# Altium schematic sheet Main.SchDoc: Main
size A3; DrawnBy: Mogens Groth Nicolaisen; DocumentNumber: 2; SheetNumber: 2; SheetTotal: 7
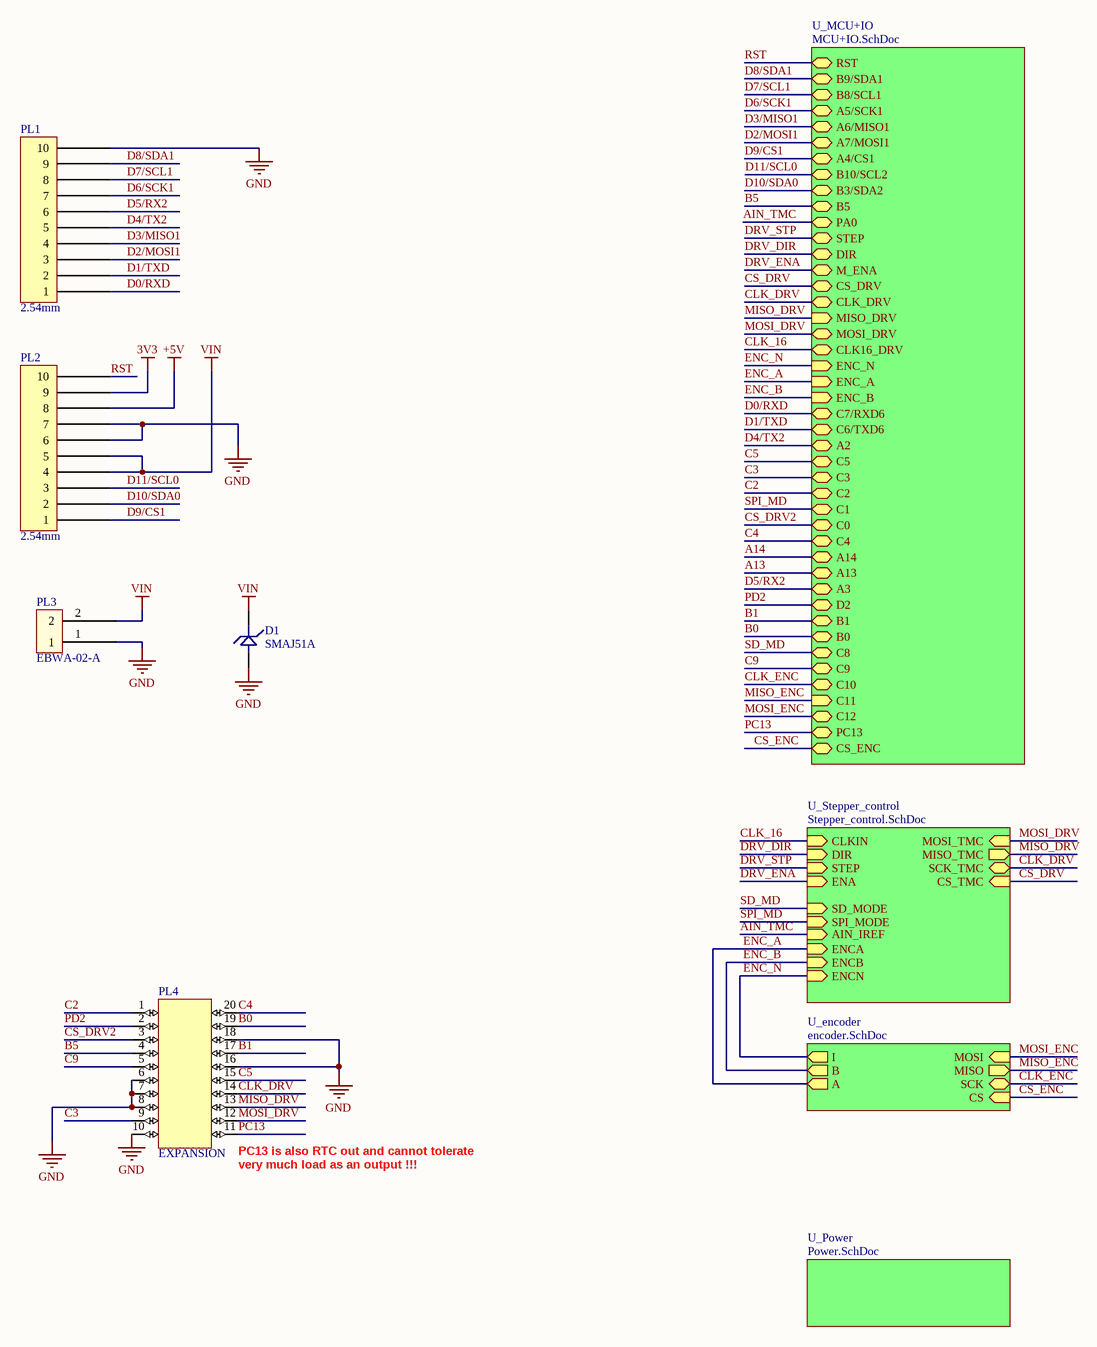
[diagram p0: Main.SchDoc]

## Parts
D1  SMAJ51A  [DIOM4227X23N]
PL1  2.54mm  [10-pin female 2.54mm]
PL2  2.54mm  [10-pin female 2.54mm]
PL3  EBWA-02-A  [691214110002]
PL4  EXPANSION  [20021121-00020T4LF-Footprint-1]

## Sub-sheets
U_encoder = encoder.SchDoc: MISO (out), MOSI (in), SCK (bidir), CS (in), A (out), B (out), I (out)
U_MCU+IO = MCU+IO.SchDoc: B9/SDA1 (bidir), B8/SCL1 (bidir), A5/SCK1 (bidir), A6/MISO1 (bidir), A7/MOSI1 (bidir), A4/CS1 (bidir), B10/SCL2 (bidir), B3/SDA2 (bidir), B5 (bidir), PA0 (bidir), STEP (bidir), DIR (bidir), M_ENA (bidir), CS_DRV (bidir), CLK_DRV (bidir), MISO_DRV (in), MOSI_DRV (bidir), CLK16_DRV (bidir), ENC_N (in), ENC_A (in), ENC_B (in), C7/RXD6 (bidir), C6/TXD6 (bidir), A2 (bidir), C5 (bidir), C3 (bidir), C2 (bidir), C1 (bidir), C0 (bidir), C4 (bidir), A14 (bidir), A13 (bidir), A3 (bidir), D2 (bidir), B1 (bidir), B0 (bidir), C8 (bidir), C9 (bidir), C10 (bidir), C11 (in), C12 (bidir), PC13 (bidir), CS_ENC (bidir), RST (bidir)
U_Power = Power.SchDoc: no entries
U_Stepper_control = Stepper_control.SchDoc: STEP (in), DIR (in), CS_TMC (in), SCK_TMC (bidir), MOSI_TMC (in), MISO_TMC (out), ENCN (in), ENCA (in), ENCB (in), SPI_MODE (in), SD_MODE (in), ENA (in), CLKIN (in), AIN_IREF (in)

## Nets
3V3: PL2.9
+5V: PL2.8
GND: D1.1 PL1.10 PL2.6 PL2.7 PL3.1 PL4.6 PL4.7 PL4.8 PL4.10 PL4.16 PL4.18
VIN: D1.3 PL2.4 PL2.5 PL3.2
A13: sheet U_MCU+IO/A13
A14: sheet U_MCU+IO/A14
AIN_TMC: sheet U_Stepper_control/AIN_IREF, sheet U_MCU+IO/PA0
B0: PL4.19 ; sheet U_MCU+IO/B0
B1: PL4.17 ; sheet U_MCU+IO/B1
B5: PL4.4 ; sheet U_MCU+IO/B5
C2: PL4.1 ; sheet U_MCU+IO/C2
C3: PL4.9 ; sheet U_MCU+IO/C3
C4: PL4.20 ; sheet U_MCU+IO/C4
C5: PL4.15 ; sheet U_MCU+IO/C5
C9: PL4.5 ; sheet U_MCU+IO/C9
CLK_16: sheet U_Stepper_control/CLKIN, sheet U_MCU+IO/CLK16_DRV
CLK_DRV: PL4.14 ; sheet U_Stepper_control/SCK_TMC, sheet U_MCU+IO/CLK_DRV
CLK_ENC: sheet U_encoder/SCK, sheet U_MCU+IO/C10
CS_DRV: sheet U_Stepper_control/CS_TMC, sheet U_MCU+IO/CS_DRV
CS_DRV2: PL4.3 ; sheet U_MCU+IO/C0
CS_ENC: sheet U_encoder/CS, sheet U_MCU+IO/CS_ENC
D0/RXD: PL1.1 ; sheet U_MCU+IO/C7/RXD6
D1/TXD: PL1.2 ; sheet U_MCU+IO/C6/TXD6
D2/MOSI1: PL1.3 ; sheet U_MCU+IO/A7/MOSI1
D3/MISO1: PL1.4 ; sheet U_MCU+IO/A6/MISO1
D4/TX2: PL1.5 ; sheet U_MCU+IO/A2
D5/RX2: PL1.6 ; sheet U_MCU+IO/A3
D6/SCK1: PL1.7 ; sheet U_MCU+IO/A5/SCK1
D7/SCL1: PL1.8 ; sheet U_MCU+IO/B8/SCL1
D8/SDA1: PL1.9 ; sheet U_MCU+IO/B9/SDA1
D9/CS1: PL2.1 ; sheet U_MCU+IO/A4/CS1
D10/SDA0: PL2.2 ; sheet U_MCU+IO/B3/SDA2
D11/SCL0: PL2.3 ; sheet U_MCU+IO/B10/SCL2
DRV_DIR: sheet U_Stepper_control/DIR, sheet U_MCU+IO/DIR
DRV_ENA: sheet U_Stepper_control/ENA, sheet U_MCU+IO/M_ENA
DRV_STP: sheet U_Stepper_control/STEP, sheet U_MCU+IO/STEP
ENC_A: sheet U_encoder/A, sheet U_Stepper_control/ENCA, sheet U_MCU+IO/ENC_A
ENC_B: sheet U_encoder/B, sheet U_Stepper_control/ENCB, sheet U_MCU+IO/ENC_B
ENC_N: sheet U_encoder/I, sheet U_Stepper_control/ENCN, sheet U_MCU+IO/ENC_N
MISO_DRV: PL4.13 ; sheet U_Stepper_control/MISO_TMC, sheet U_MCU+IO/MISO_DRV
MISO_ENC: sheet U_encoder/MISO, sheet U_MCU+IO/C11
MOSI_DRV: PL4.12 ; sheet U_Stepper_control/MOSI_TMC, sheet U_MCU+IO/MOSI_DRV
MOSI_ENC: sheet U_encoder/MOSI, sheet U_MCU+IO/C12
PC13: PL4.11 ; sheet U_MCU+IO/PC13
PD2: PL4.2 ; sheet U_MCU+IO/D2
RST: PL2.10 ; sheet U_MCU+IO/RST
SD_MD: sheet U_Stepper_control/SD_MODE, sheet U_MCU+IO/C8
SPI_MD: sheet U_Stepper_control/SPI_MODE, sheet U_MCU+IO/C1

## Notes on the sheet
- (near PL4) PC13 is also RTC out and cannot tolerate very much load as an output !!!
- ON Development
- Title:
- Size:
- A3
- Drawn By:
- Date:
- Sheet
- of
- Revision:

## Library data of the parts
D1 = CMP-016-0017-0.2: Diode TVS Single Uni-Dir 51V 400W 2-Pin SMA; Direction: Unidirectional; Operating Supply Voltage: 3.5V; Max Surge Current: 40A; Reverse Breakdown Voltage: 56.7V; Breakdown Voltage: 62.7V; Number of Channels: 1; Clamping Voltage: 82.4V; Power Line Protection: No; Max Reverse Leakage Current: 5uA; Test Current: 1mA; Peak Pulse Current: 4.9A; Mount: Surface Mount; Case/Package: SMA; Number of Pins: 2; Min Operating Temperature: -55°C; Max Operating Temperature: 150°C; Packaging: Tape and Reel; Package Quantity: 1; Polarity: Unidirectional; Peak Pulse Power: 400W; Termination: SMD/SMT; Number of Unidirectional Channels: 1; Reverse Standoff Voltage: 51V; Min Breakdown Voltage: 56.7V; Number of Elements: 1; Element Configuration: Single; Leakage Current: 5uA; Composition: Zener; Radiation Hardening: No; Mfg. Part Number: SMAJ51A
PL1 PL2 = CMP-003-0004-2: Pin header 10-pin 2.54mm female; Mfg. Part Number: DS1023-1*10S21
PL3 = CMP-003-0031-0.0: Current: 10A; Wire gauge: 16-28 AWG; Mfg. Part Number: EBWA-02-A
PL4 = CMP-003-0038-0.0: Conn Unshrouded Header HDR 20 POS 1.27mm Solder ST Top Entry SMD Tube; Connector Type: Male Pin; Contact Resistance: 30mR; Current Rating: 20A; Gender: Male; Max Voltage Rating (AC): 125V; Number of Contacts: 20; Row Spacing: 0.05inch; Color: Black; Contact Material: Nickel; Contact Mating Length: 0.12inch; Contact Plating: Gold; Contact Type: Male Pin; Depth: 3.4mm; Housing Color: Black; Housing Material: Plastic; Length: 12.7mm; Max Operating Temperature: 85°C; Min Operating Temperature: -40°C; Mount: Surface Mount; Number of Positions: 20; Number of Rows: 2; Orientation: Straight; Package Quantity: 46; Packaging: Rail/Tube; Pitch: 1.27mm; RoHS Compliant: Yes; Series: Minitek 127® 20021121; Termination: Solder; Voltage Rating: 125V